# Altium schematic sheet Front End.SchDoc
size A; SheetNumber: 1; SheetTotal: 1
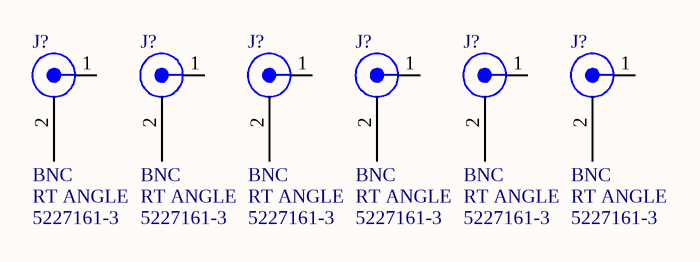
[diagram p0: Front End.SchDoc]

## Parts
(Parts that share a designator on the sheet are numbered #1, #2 ... from top to bottom, then left to right.)
J?#1  BNC  value RT ANGLE  Manf P/N: 5227161-3  [URF/BNC/R1.350/FIXED]
J?#2  BNC  value RT ANGLE  Manf P/N: 5227161-3  [URF/BNC/R1.350/FIXED]
J?#3  BNC  value RT ANGLE  Manf P/N: 5227161-3  [URF/BNC/R1.350/FIXED]
J?#4  BNC  value RT ANGLE  Manf P/N: 5227161-3  [URF/BNC/R1.350/FIXED]
J?#5  BNC  value RT ANGLE  Manf P/N: 5227161-3  [URF/BNC/R1.350/FIXED]
J?#6  BNC  value RT ANGLE  Manf P/N: 5227161-3  [URF/BNC/R1.350/FIXED]

## Nets

Not connected (* = marked no-connect by the designer): J?#1 1(CENTER) 2(SHIELD); J?#2 1(CENTER) 2(SHIELD); J?#3 1(CENTER) 2(SHIELD); J?#4 1(CENTER) 2(SHIELD); J?#5 1(CENTER) 2(SHIELD); J?#6 1(CENTER) 2(SHIELD)

## Library data of the parts
J?#1-J?#6 = 1-00233: BNC, PCB Panel Mount, Right Angle, Isolated; Manf: TYCO; Cat1: Thru-hole; Cat2: Coax; Part Number: 1-00233; Type: Connector\Thru-hole\Coax\BNC; ComponentLink2URL: http://srsdata.corp.thinksrs.com:3838/ShinyParts/?Detail=100233; ComponentLink1URL: http://ventura.corp.thinksrs.com/datasheets/100233/datasheet.pdf; ComponentLink2Description: Info; ComponentLink1Description: datasheet; Cat3: BNC